# Altium schematic sheet cover_page.SchDoc
size A3; SheetNumber: 1; SheetTotal: 21
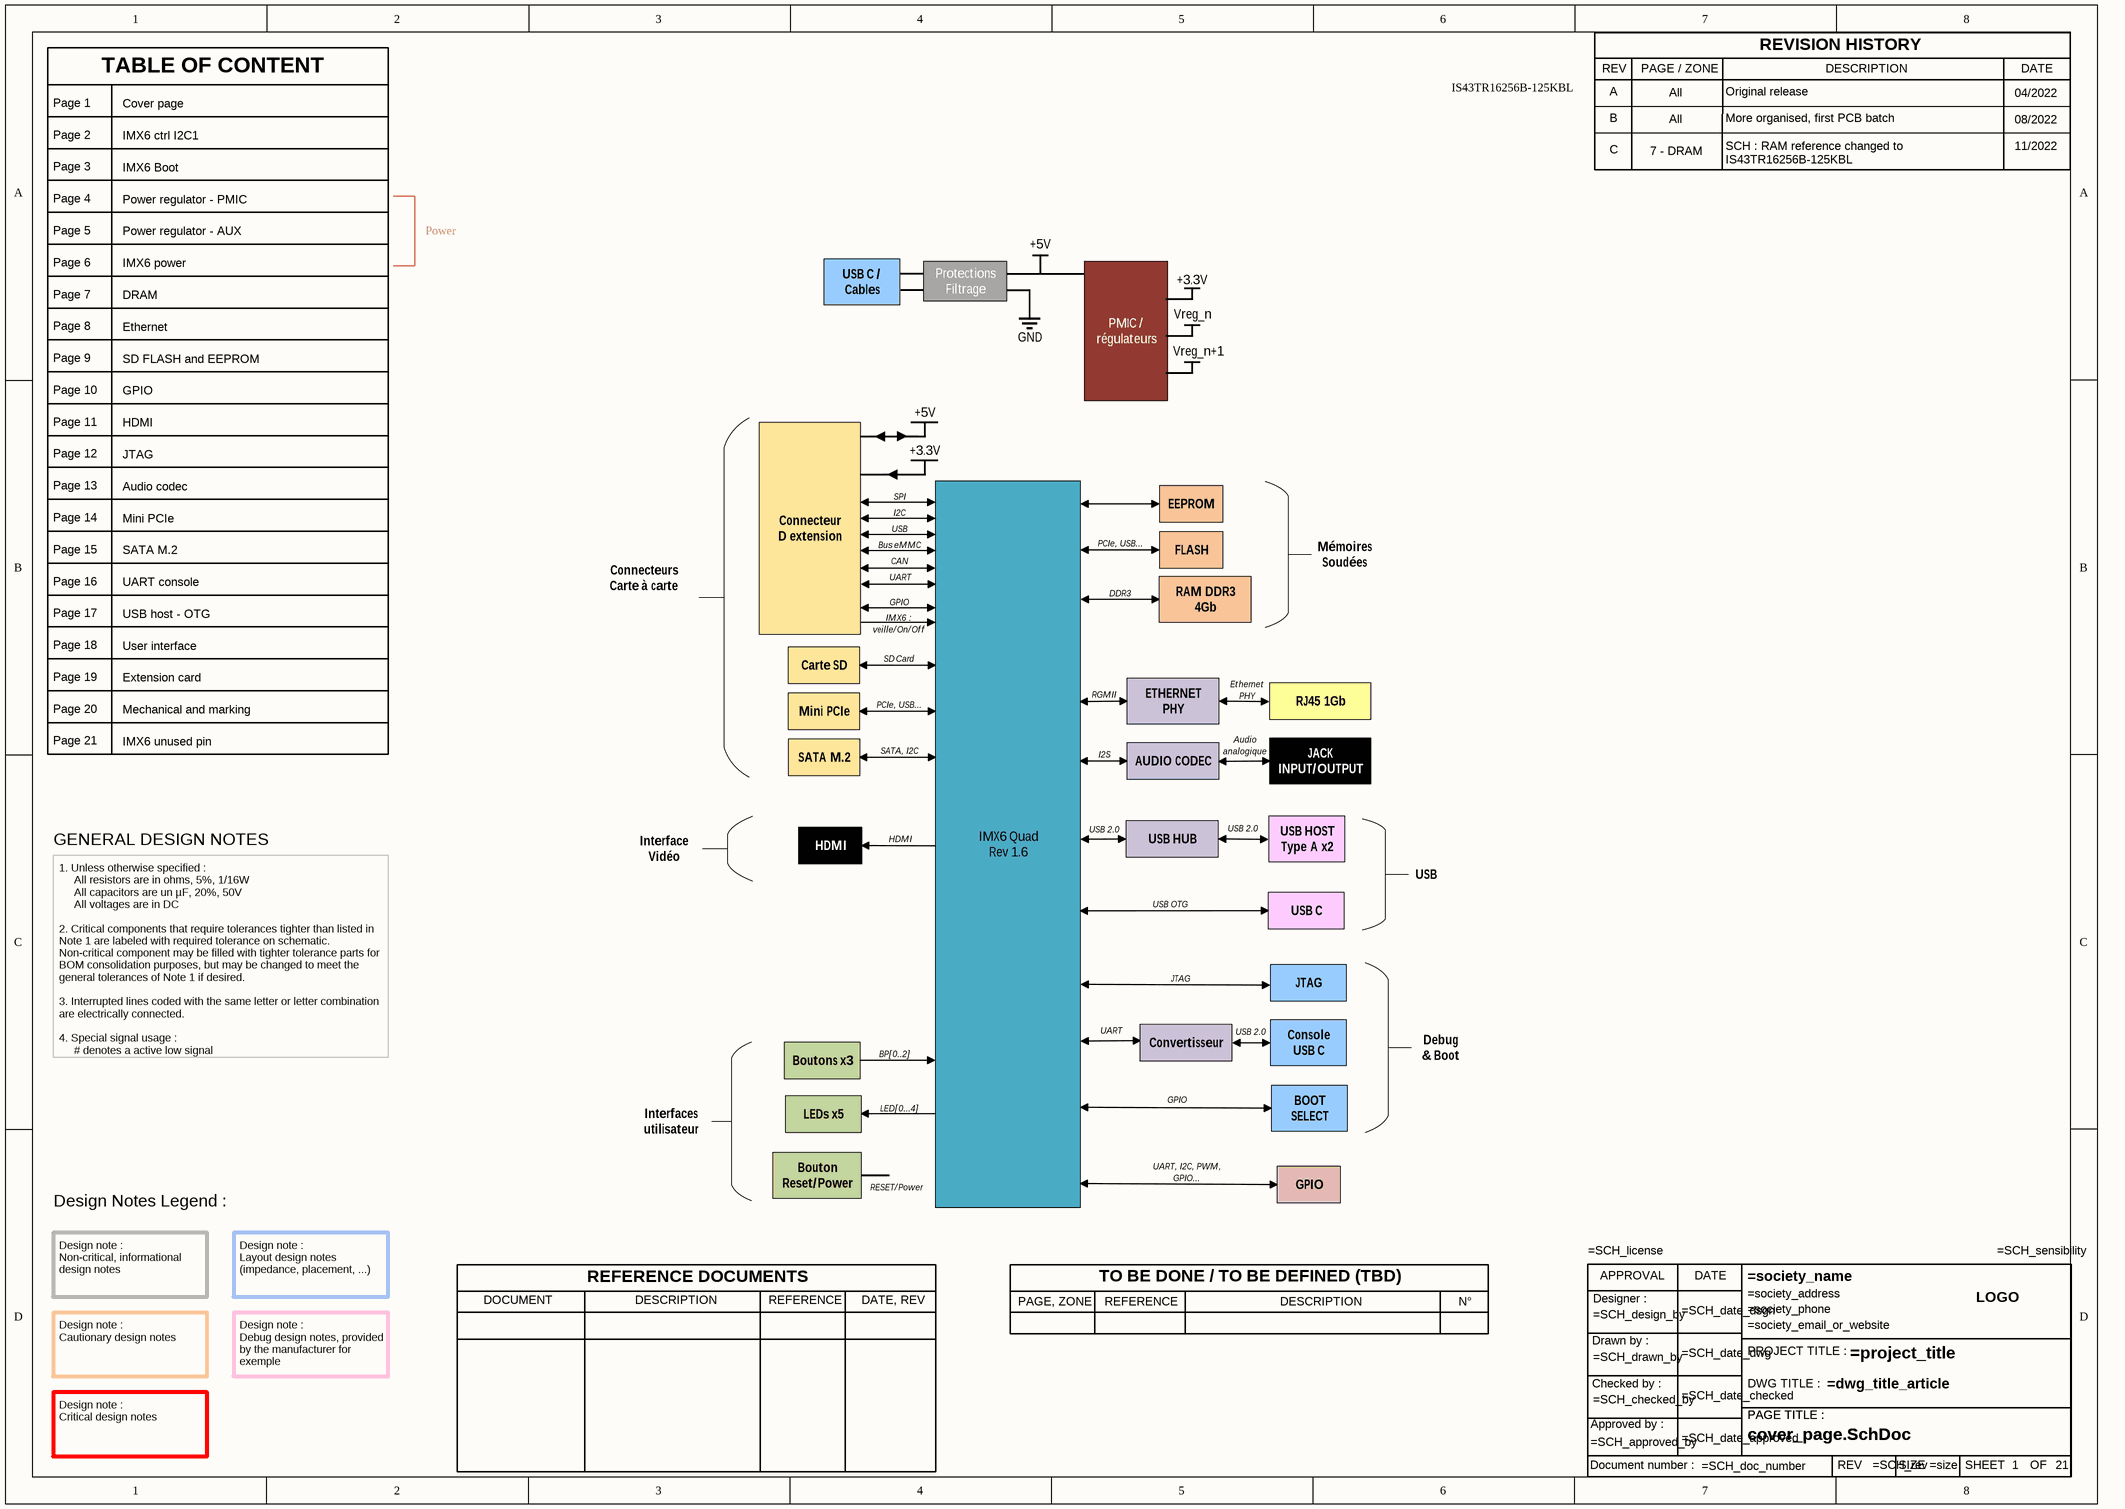
[diagram p0: cover_page.SchDoc]

## Parts
TB1  Title bloc ANSI modified  (value not drawn)

## Notes on the sheet
- Page 1
- TABLE OF CONTENT
- Cover page
- IS43TR16256B-125KBL
- REV
- A
- PAGE / ZONE
- All
- Original release
- REVISION HISTORY
- DESCRIPTION
- 04/2022
- DATE
- Page 2
- Page 3
- IMX6 ctrl I2C1
- IMX6 Boot
- B
- C
- 7 - DRAM
- More organised, first PCB batch
- SCH : RAM reference changed to IS43TR16256B-125KBL
- 08/2022
- 11/2022
- Page 4
- Page 5
- Power regulator - PMIC
- Power regulator - AUX
- Power
- Page 6
- Page 7
- IMX6 power
- DRAM
- Page 8
- Page 9
- Ethernet
- SD FLASH and EEPROM
- Page 10
- Page 11
- GPIO
- HDMI
- Page 12
- Page 13
- JTAG
- Audio codec
- Page 14
- Page 15
- Page 16
- Mini PCIe
- SATA M.2
- UART console
- Page 17
- Page 18
- USB host - OTG
- User interface
- Page 19
- Page 20
- Extension card
- Mechanical and marking
- Page 21
- IMX6 unused pin
- GENERAL DESIGN NOTES
- 1. Unless otherwise specified :
  All resistors are in ohms, 5%, 1/16W
  All capacitors are un µF, 20%, 50V
  All voltages are in DC
  2. Critical components that require tolerances tighter than listed in Note 1 are labeled with required tolerance on schematic. Non-critical component may be filled with tighter tolerance parts for BOM consolidation purposes, but may be changed to meet the general tolerances of Note 1 if desired.
  3. Interrupted lines coded with the same letter or letter combination are electrically connected.
  4. Special signal usage :
  # denotes a active low signal
- Design Notes Legend :
- Design note :
  Non-critical, informational design notes
- Design note :
  Layout design notes (impedance, placement, ...)
- DOCUMENT
- REFERENCE DOCUMENTS
- REFERENCE
- DATE, REV
- PAGE, ZONE
- TO BE DONE / TO BE DEFINED (TBD)
- N°
- Design note :
  Cautionary design notes
- Design note :
  Debug design notes, provided by the manufacturer for exemple
- Design note :
  Critical design notes
- (in symbol Title bloc ANSI) APPROVAL; DATE; Designer :; LOGO; Drawn by :; PROJECT TITLE :; Checked by :; DWG TITLE :; PAGE TITLE :; Approved by :; Document number :; REV; SIZE; SHEET; OF

## Library data of the parts
TB1 = Title bloc ANSI